# EasyEDA schematic ETC_SCH_2025-07-03.json
TITLE: TSET; REV: 2.0; Date: 2025-06-12; Sheet: 1/1; Drawn By: fcttt; Company: 长大一队
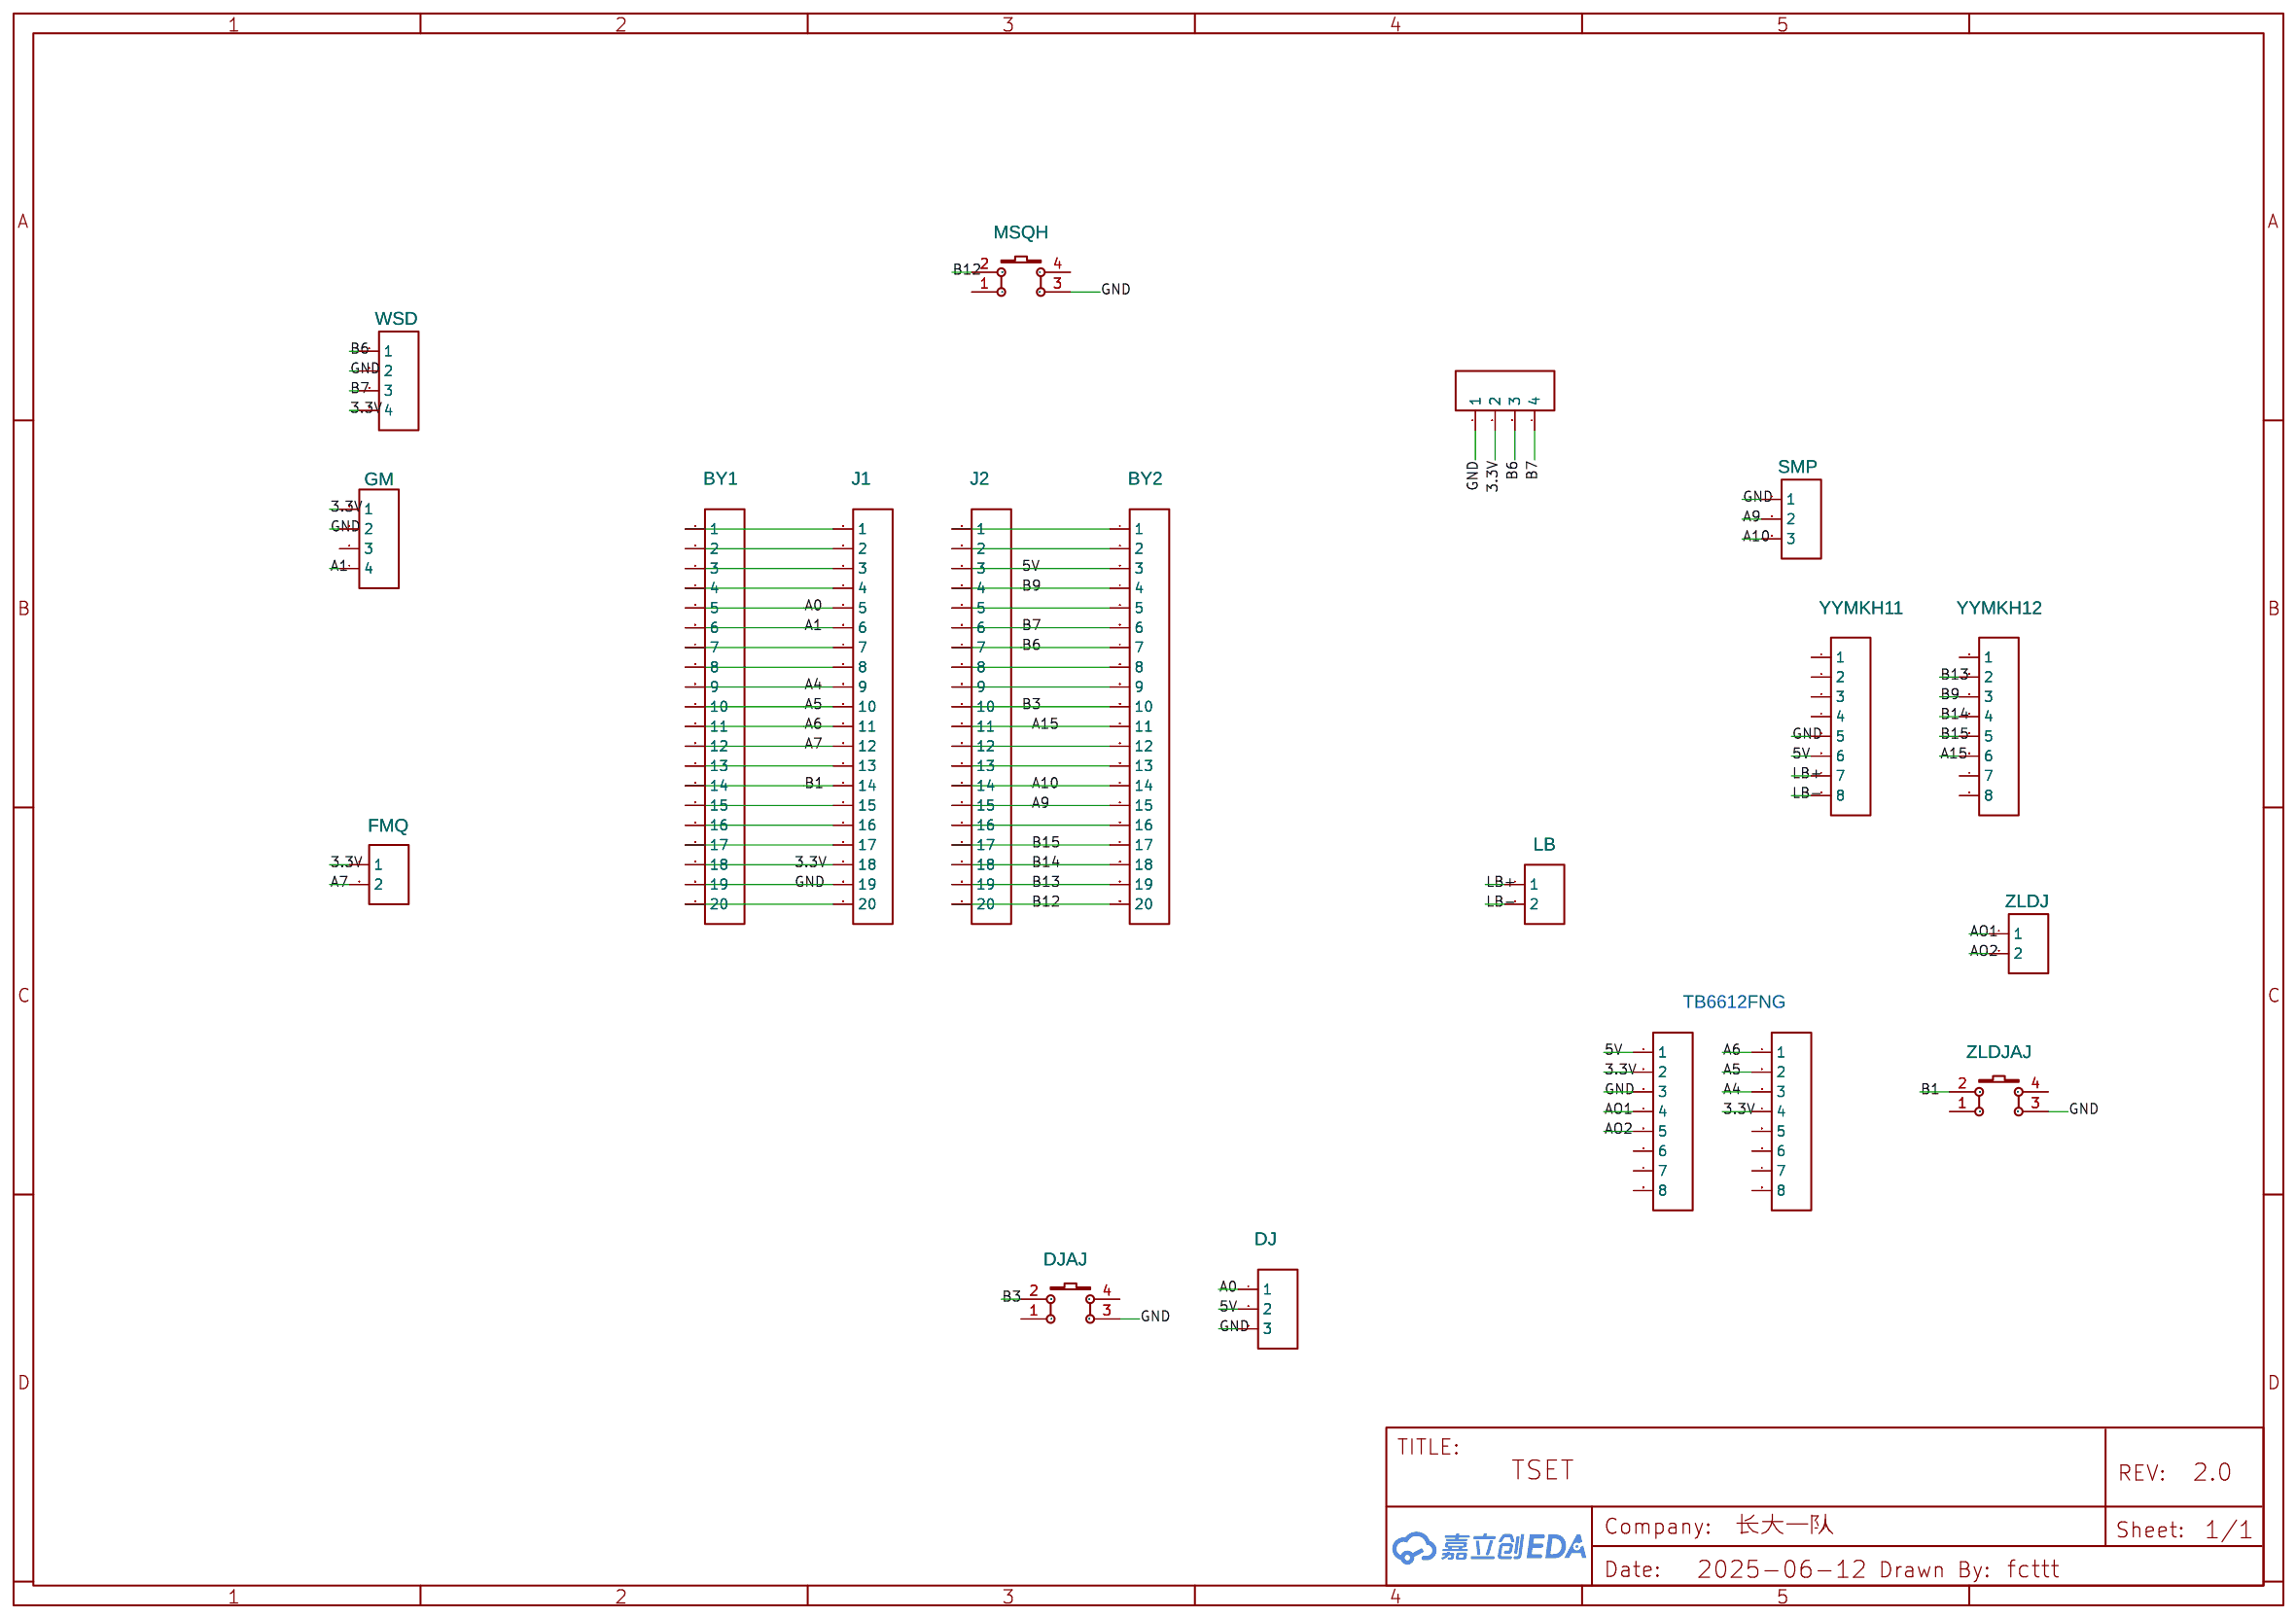
[diagram p0: schematic sheet]

## Parts
BY1  HDR-M-2.54_1x20  [HDR-M-2.54_1X20]
BY2  HDR-M-2.54_1x20  [HDR-M-2.54_1X20]
DJ  HDR-F-2.54_1x3  [HDR-F-2.54_1X3]
DJAJ  DJAJ  [KEY-TH_4P-L6.0-W6.0-P4.50-LS6.5]
FMQ  HDR-F-2.54_1x2  [HDR-F-2.54_1X2]
GM  GM  [HDR-F-2.54_1X4]
J1  HDR-M-2.54_1x20  [HDR-M-2.54_1X20]
J2  HDR-M-2.54_1x20  [HDR-M-2.54_1X20]
LB  HDR-F-2.54_1x2  [HDR-F-2.54_1X2]
MSQH  K4-6×6_TH  [KEY-TH_4P-L6.0-W6.0-P4.50-LS6.5]
OLED  OLED  [HDR-F-2.54_1X4]
SMP  SMP  [HDR-F-2.54_1X3]
TB6612H9  HDR-F-2.54_1x8  [HDR-F-2.54_1X8]
TB6612H10  HDR-F-2.54_1x8  [HDR-F-2.54_1X8]
WSD  WSD  [HDR-F-2.54_1X4]
YYMKH11  HDR-F-2.54_1x8  [HDR-F-2.54_1X8]
YYMKH12  HDR-F-2.54_1x8  [HDR-F-2.54_1X8]
ZLDJ  ZLDJ  [HDR-F-2.54_1X2]
ZLDJAJ  K4-6×6_TH  [KEY-TH_4P-L6.0-W6.0-P4.50-LS6.5]

## Library data of the parts
BY1 BY2 J1 J2 = HDR-M-2.54_1x20: Supplier Part: C50981; Supplier: LCSC; Contributor: LCEDA_Lib
DJ SMP = HDR-F-2.54_1x3: Supplier Part: C146690; Supplier: LCSC; Contributor: LCEDA_Lib
DJAJ MSQH ZLDJAJ = K4-6×6_TH: Supplier: LCSC; Supplier Part: C136684; Manufacturer: 韩国韩荣; Manufacturer Part: K2-1102DP-E4SW-04; Contributor: LCEDA_Lib
FMQ LB ZLDJ = HDR-F-2.54_1x2: Supplier Part: C49661; Supplier: LCSC; Contributor: LCEDA_Lib
GM OLED WSD = HDR-F-2.54_1x4: Supplier Part: C225501; Supplier: LCSC; Contributor: LCEDA_Lib
TB6612H9 TB6612H10 YYMKH11 YYMKH12 = HDR-F-2.54_1x8: Supplier Part: C225505; Supplier: LCSC; Contributor: LCEDA_Lib

## Nets
3.3V: BY1.18 FMQ.1 GM.1 J1.18 OLED.2 TB6612H9.2 TB6612H10.4 WSD.4
5V: BY2.3 DJ.2 J2.3 TB6612H9.1 YYMKH11.6
GND: BY1.19 DJ.3 DJAJ.3 GM.2 J1.19 MSQH.3 OLED.1 SMP.1 TB6612H9.3 WSD.2 YYMKH11.5 ZLDJAJ.3
A0: BY1.5 DJ.1 J1.5
A1: BY1.6 GM.4 J1.6
A4: BY1.9 J1.9 TB6612H10.3
A5: BY1.10 J1.10 TB6612H10.2
A6: BY1.11 J1.11 TB6612H10.1
A7: BY1.12 FMQ.2 J1.12
A9: BY2.15 J2.15 SMP.2
A10: BY2.14 J2.14 SMP.3
A15: BY2.11 J2.11 YYMKH12.6
AO1: TB6612H9.4 ZLDJ.1
AO2: TB6612H9.5 ZLDJ.2
B1: BY1.14 J1.14 ZLDJAJ.2
B3: BY2.10 DJAJ.2 J2.10
B6: BY2.7 J2.7 OLED.3 WSD.1
B7: BY2.6 J2.6 OLED.4 WSD.3
B9: BY2.4 J2.4 YYMKH12.3
B12: BY2.20 J2.20 MSQH.2
B13: BY2.19 J2.19 YYMKH12.2
B14: BY2.18 J2.18 YYMKH12.4
B15: BY2.17 J2.17 YYMKH12.5
LB+: LB.1 YYMKH11.7
LB-: LB.2 YYMKH11.8
Net-(BY1-1): BY1.1 J1.1
Net-(BY1-2): BY1.2 J1.2
Net-(BY1-3): BY1.3 J1.3
Net-(BY1-4): BY1.4 J1.4
Net-(BY1-7): BY1.7 J1.7
Net-(BY1-8): BY1.8 J1.8
Net-(BY1-13): BY1.13 J1.13
Net-(BY1-15): BY1.15 J1.15
Net-(BY1-16): BY1.16 J1.16
Net-(BY1-17): BY1.17 J1.17
Net-(BY1-20): BY1.20 J1.20
Net-(BY2-1): BY2.1 J2.1
Net-(BY2-2): BY2.2 J2.2
Net-(BY2-5): BY2.5 J2.5
Net-(BY2-8): BY2.8 J2.8
Net-(BY2-9): BY2.9 J2.9
Net-(BY2-12): BY2.12 J2.12
Net-(BY2-13): BY2.13 J2.13
Net-(BY2-16): BY2.16 J2.16

Not connected (* = marked no-connect by the designer): DJAJ 1 4; GM 3; MSQH 1 4; TB6612H9 6 7 8; TB6612H10 5 6 7 8; YYMKH11 1 2 3 4; YYMKH12 1 7 8; ZLDJAJ 1 4

## Notes on the sheet
- TB6612FNG
